# EAGLE schematic fuel (EAGLE 6.4)
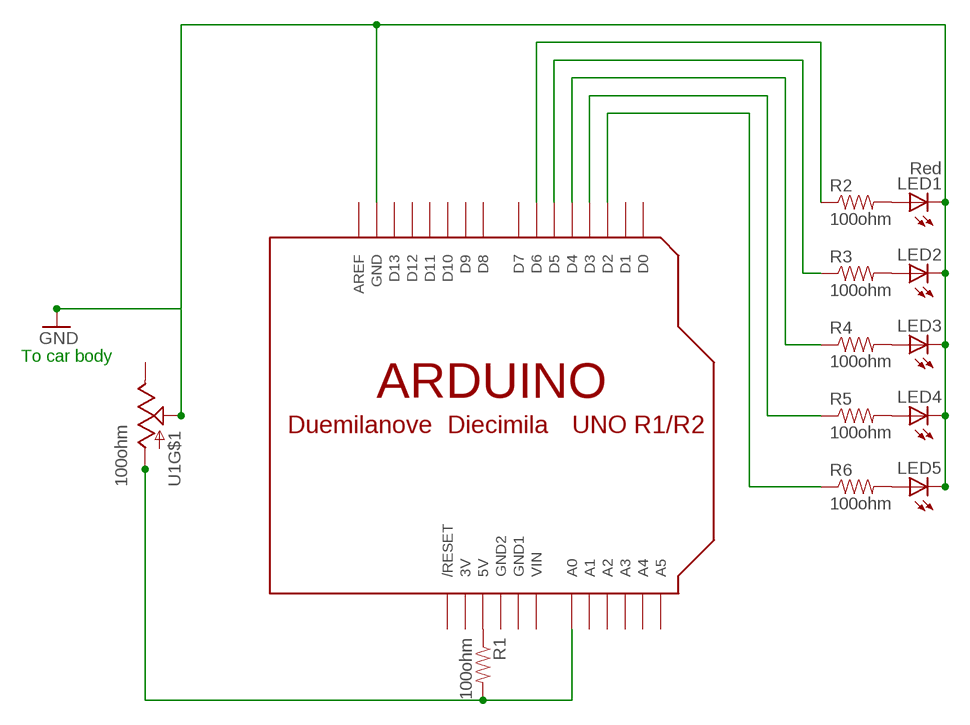
[diagram p0: schematic, sheet 1]

## Parts
LED1  Red  LEDB152  [Q62902-B152]
LED2  LEDB152  [Q62902-B152]
LED3  LEDB152  [Q62902-B152]
LED4  LEDB152  [Q62902-B152]
LED5  LEDB152  [Q62902-B152]
R1  100ohm  RESISTOR0402-RES  [0402-RES]
R2  100ohm  RESISTOR0402-RES  [0402-RES]
R3  100ohm  RESISTOR0402-RES  [0402-RES]
R4  100ohm  RESISTOR0402-RES  [0402-RES]
R5  100ohm  RESISTOR0402-RES  [0402-RES]
R6  100ohm  RESISTOR0402-RES  [0402-RES]
U1  100ohm  POT_SWITCHPOT_PTH  [POT_PTH]
U$1  ARDUINOUNO  [ARDUINO]

## Nets
GND: LED1.K(C) LED2.K(C) LED3.K(C) LED4.K(C) LED5.K(C) U1.WAND(S) U$1.GND
N$1: R1.1 U$1.5V
N$2: LED1.A R2.2
N$4: LED2.A R3.2
N$5: LED3.A R4.2
N$6: LED4.A R5.2
N$7: LED5.A R6.2
N$8: R2.1 U$1.D6
N$9: R3.1 U$1.D5
N$10: R4.1 U$1.D4
N$11: R5.1 U$1.D3
N$12: R6.1 U$1.D2
R7: R1.2 U1.E@1(A) U$1.A0
Unconnected: U1.E@2(E) U1.S1 U1.S2 U$1.A1 U$1.A2 U$1.A3 U$1.A4 U$1.A5 U$1.AREF U$1.D0 U$1.D1 U$1.D7 U$1.D8 U$1.D9 U$1.D10 U$1.D11 U$1.D12 U$1.D13 U$1.RESET(/RESET)

## Notes on the sheet
- To car body

## Power pins joined to a net without a drawn wire
3V: U$1.3V
GND1: U$1.GND1
GND2: U$1.GND2
VIN: U$1.VIN

## Library data of the parts
LED1-LED5 = adafruit:LED: LED OSRAM: - CHIPLED LG R971, LG N971, LY N971, LG Q971, LY Q971, LO R971, LY R971 LH N974, LH R974 LS Q976, LO Q976, LY Q976 LO Q996 - Hyper CHIPLED LW Q18S LB Q993, LB Q99A, LB R99A - SideLED LS A670, LO A670, LY A670, LG A670, LP A670 LB A673, LV A673, LT A673, LW A673 LH A674 LY A675 LS A676, LA A676, LO A676, LY A676, LW A676 LS A679, LY A679, LG A679 - Hyper Micro SIDELED® LS Y876, LA Y876, LO Y876, LY Y876 LT Y87S - SmartLED LW L88C, LW L88S LB L89C, LB L89S, LG L890 LS L89K, LO L89K, LY L89K LS L896, LA L896, LO L896, LY L896 - TOPLED LS T670, LO T670, LY T670, LG T670, LP T670 LSG T670, LSP T670, LSY T670, LOP T670, LYG T670 LG T671, LOG T671, LSG T671 LB T673, LV T673, LT T673, LW T673 LH T674 LS T676, LA T676, LO T676, LY T676, LB T676, LH T676, LSB T676, LW T676 LB T67C, LV T67C, LT T67C, LS T67K, LO T67K, LY T67K, LW E67C LS E67B, LA E67B, LO E67B, LY E67B, LB E67C, LV E67C, LT E67C LW T67C LS T679, LY T679, LG T679 LS T770, LO T770, LY T770, LG T770, LP T770 LB T773, LV T773, LT T773, LW T773 LH T774 LS E675, LA E675, LY E675, LS T675 LS T776, LA T776, LO T776, LY T776, LB T776 LHGB T686 LT T68C, LB T68C - Hyper Mini TOPLED® LB M676 - Mini TOPLED Santana® LG M470 LS M47K, LO M47K, LY M47K Source: http://www.osram.convergy.de/
R1-R6 = SparkFun-Passives:RESISTOR: Resistor Basic schematic elements and footprints for 0603, 1206, and PTH resistors.
U1 = SparkFun-Electromechanical:POT_SWITCH: Potentiometer w/ switch.
U$1 = adafruit:ARDUINO: Arduino Diecimila/Duemilanove Make a shield with ease, this package has all the named pins as well as the two mounting drill holes and an outline of the USB and DC power connector. The outline is on the DIMENSION layer, so if your board house uses it they will cut the outline to match. http://www.ladyada.net/library/pcb/eaglelibrary.html